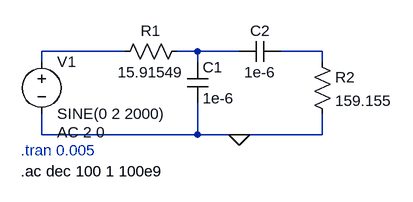
[diagram p0: schematic Band pass filter.asc]
Band pass filter.asc, the LTspice schematic file:
Version 4.1
SHEET 1 880 680
WIRE 48 96 -80 96
WIRE 160 96 128 96
WIRE 224 96 160 96
WIRE 352 96 288 96
WIRE -80 112 -80 96
WIRE 160 112 160 96
WIRE 352 112 352 96
WIRE -80 224 -80 192
WIRE 160 224 160 176
WIRE 160 224 -80 224
WIRE 224 224 160 224
WIRE 352 224 352 192
WIRE 352 224 224 224
FLAG 224 224 0
SYMBOL res 144 80 R90
WINDOW 0 0 56 VBottom 2
WINDOW 3 32 56 VTop 2
SYMATTR InstName R1
SYMATTR Value 15.91549
SYMBOL cap 144 112 R0
SYMATTR InstName C1
SYMATTR Value 1e-6
SYMBOL cap 288 80 R90
WINDOW 0 0 32 VBottom 2
WINDOW 3 32 32 VTop 2
SYMATTR InstName C2
SYMATTR Value 1e-6
SYMBOL res 336 96 R0
SYMATTR InstName R2
SYMATTR Value 159.155
SYMBOL voltage -80 96 R0
WINDOW 123 24 124 Left 2
WINDOW 39 0 0 Left 0
SYMATTR Value2 AC 2 0
SYMATTR InstName V1
SYMATTR Value SINE(0 2 2000)
TEXT -112 248 Left 2 ;.tran 0.005
TEXT -112 280 Left 2 !.ac dec 100 1 100e9

The netlist it stands for:
* Band pass filter.asc
R1 N002 N001 15.91549
C1 N002 0 1e-6
C2 N003 N002 1e-6
R2 N003 0 159.155
V1 N001 0 SINE(0 2 2000) AC 2 0
* .tran 0.005
.ac dec 100 1 100e9
.backanno
.end